# EAGLE design Hermit Board Rev A6 (EAGLE 6.6.0)
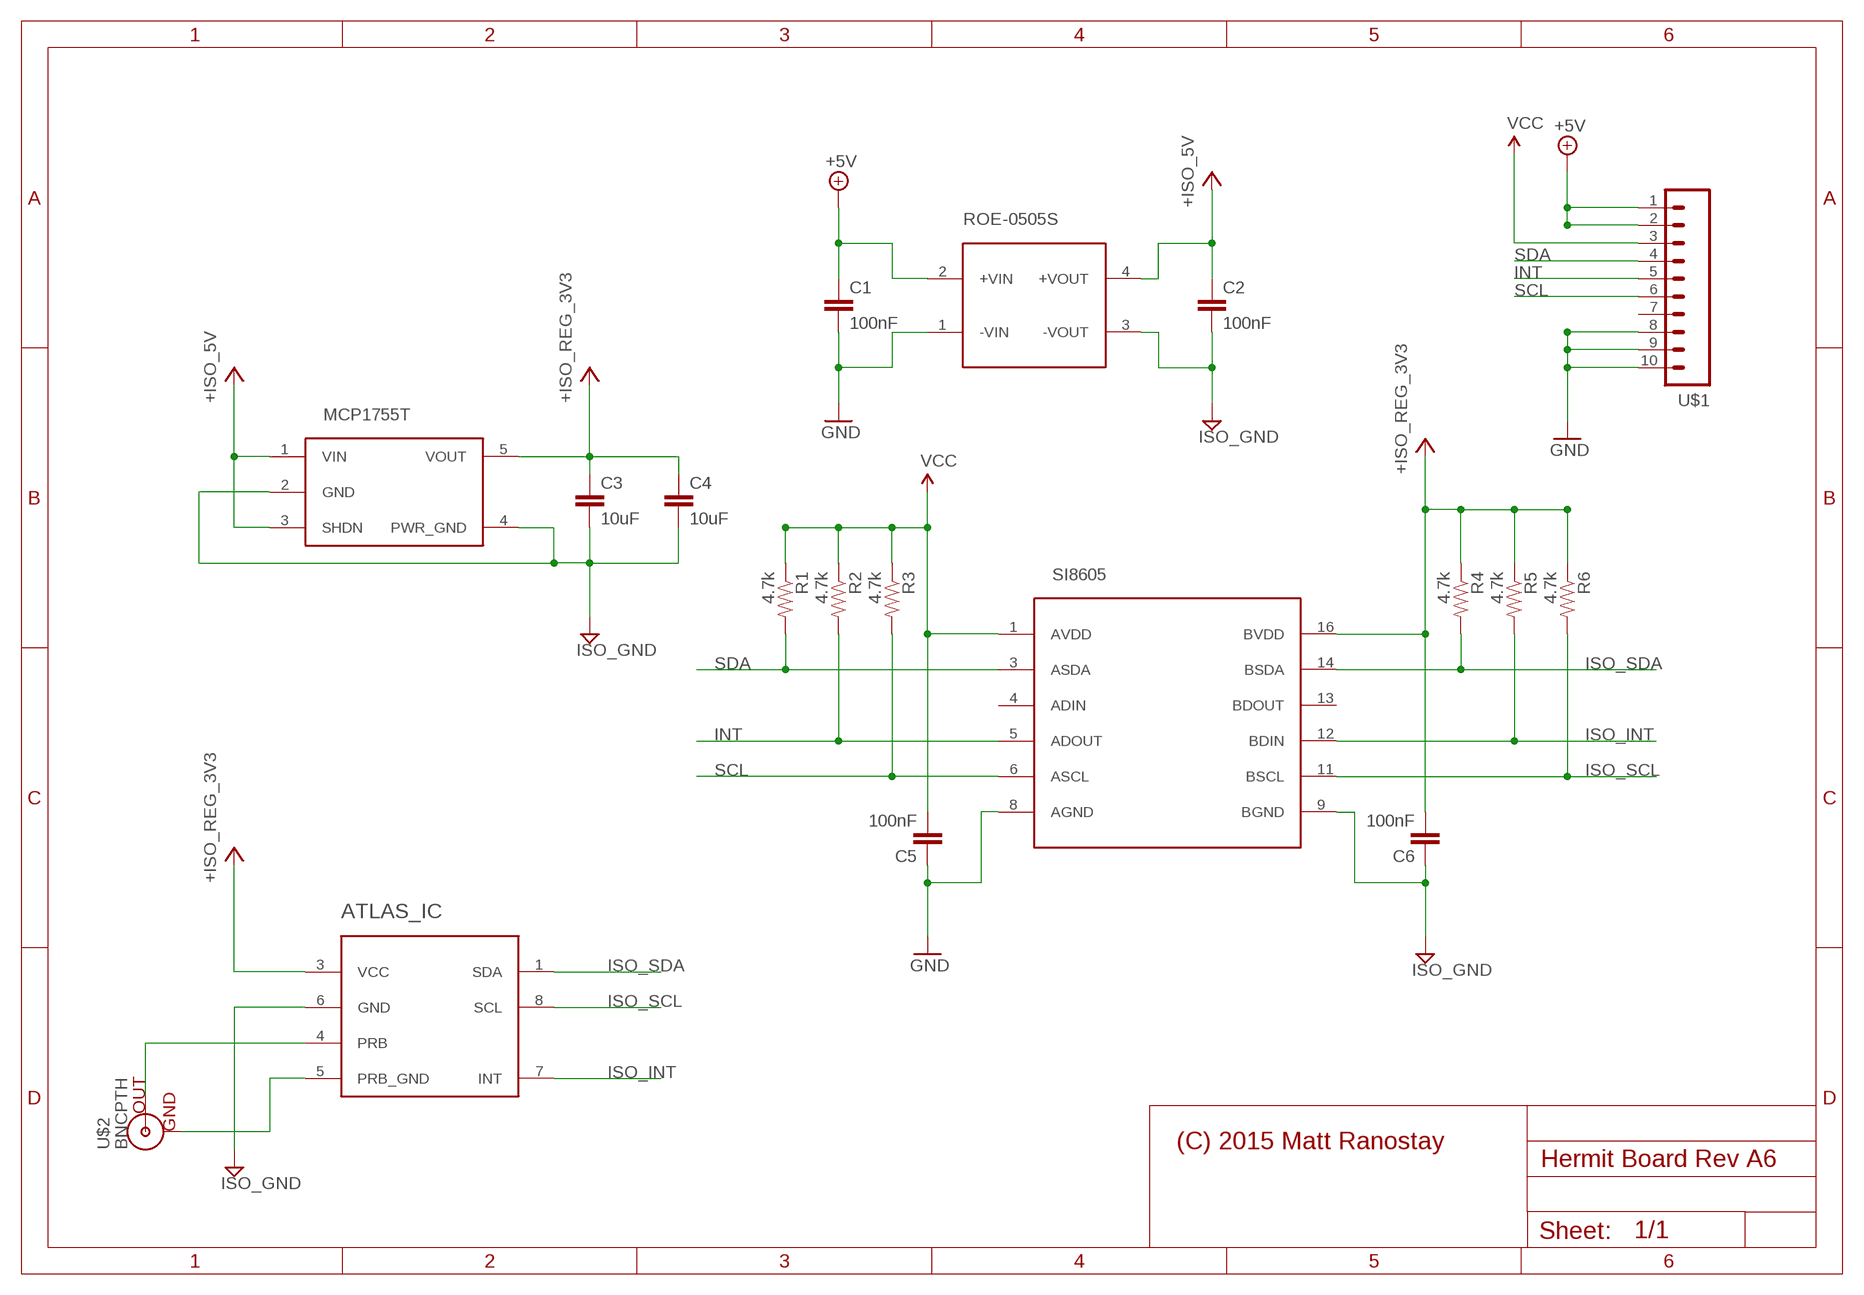
[diagram p0: schematic, sheet 1]

## Parts
ATLAS_IC  ATLAS-OEM  [ATLAS-OEM]
C1  100nF  CAP0805  [0805]
C2  100nF  CAP0805  [0805]
C3  10uF  CAP0805  [0805]
C4  10uF  CAP0805  [0805]
C5  100nF  CAP0805  [0805]
C6  100nF  CAP0805  [0805]
MCP1755T  MCP1755T  [SOT-23-5]
R1  4.7k  RESISTOR0805-RES  [0805]
R2  4.7k  RESISTOR0805-RES  [0805]
R3  4.7k  RESISTOR0805-RES  [0805]
R4  4.7k  RESISTOR0805-RES  [0805]
R5  4.7k  RESISTOR0805-RES  [0805]
R6  4.7k  RESISTOR0805-RES  [0805]
ROE-0505S  ROE-0505S  [SIP4]
SI8605  SI8605  [SOIC16-1.27-10X3.9MM]
U$1  M10SILK_FEMALE_PTH  [1X10]
U$2  BNCPTH  [BNC]

## Nets
+3V3: ATLAS_IC.3(VCC) C3.1 C4.1 C6.2 MCP1755T.5(VOUT) R4.1 R5.1 R6.1 SI8605.16(BVDD) ; supply symbol labelled +ISO_REG_3V3
+5V: C1.1 ROE-0505S.2(+VIN) U$1.1 U$1.2
+ISO_5V: C2.1 MCP1755T.1(VIN) MCP1755T.3(SHDN) ROE-0505S.4(+VOUT)
GND: C1.2 C5.1 ROE-0505S.1(-VIN) SI8605.8(AGND) U$1.8 U$1.9 U$1.10
INT: R2.2 SI8605.5(ADOUT) U$1.5
ISO_GND: ATLAS_IC.6(GND) C2.2 C3.2 C4.2 C6.1 MCP1755T.2(GND) MCP1755T.4(PWR_GND) ROE-0505S.3(-VOUT) SI8605.9(BGND)
ISO_INT: ATLAS_IC.7(INT) R5.2 SI8605.12(BDIN)
ISO_SCL: ATLAS_IC.8(SCL) R6.2 SI8605.11(BSCL)
ISO_SDA: ATLAS_IC.1(SDA) R4.2 SI8605.14(BSDA)
N$5: ATLAS_IC.4(PRB) U$2.S(OUT)
PRB_GND: ATLAS_IC.5(PRB_GND) U$2.GND
SCL: R3.2 SI8605.6(ASCL) U$1.6
SDA: R1.2 SI8605.3(ASDA) U$1.4
VCC: C5.2 R1.1 R2.1 R3.1 SI8605.1(AVDD) U$1.3
Unconnected: SI8605.4(ADIN) SI8605.13(BDOUT) U$1.7

## Notes on the sheet
- (C) 2015 Matt Ranostay

## Library data of the parts
ATLAS_IC = mranostay:ATLAS-OEM
C1-C6 = SparkFun-Capacitors:CAP: Capacitor Standard 0603 ceramic capacitor, and 0.1" leaded capacitor.
MCP1755T = mranostay:MCP1755T
R1-R6 = SparkFun-Passives:RESISTOR: Resistor Basic schematic elements and footprints for 0603, 1206, and PTH resistors.
ROE-0505S = mranostay:ROE-0505S
SI8605 = mranostay:SI8605
U$1 = SparkFun-Connectors:M10: Header 10 Standard 10-pin 0.1" header. Use with straight break away headers (SKU : PRT-00116), right angle break away headers (PRT-00553), swiss pins (PRT-00743), machine pins (PRT-00117), and female headers (PRT-00115).; PROD_ID: CONN-11563
U$2 = mranostay:BNC: BNC Connector, Mouser Part# 5227161

## Board
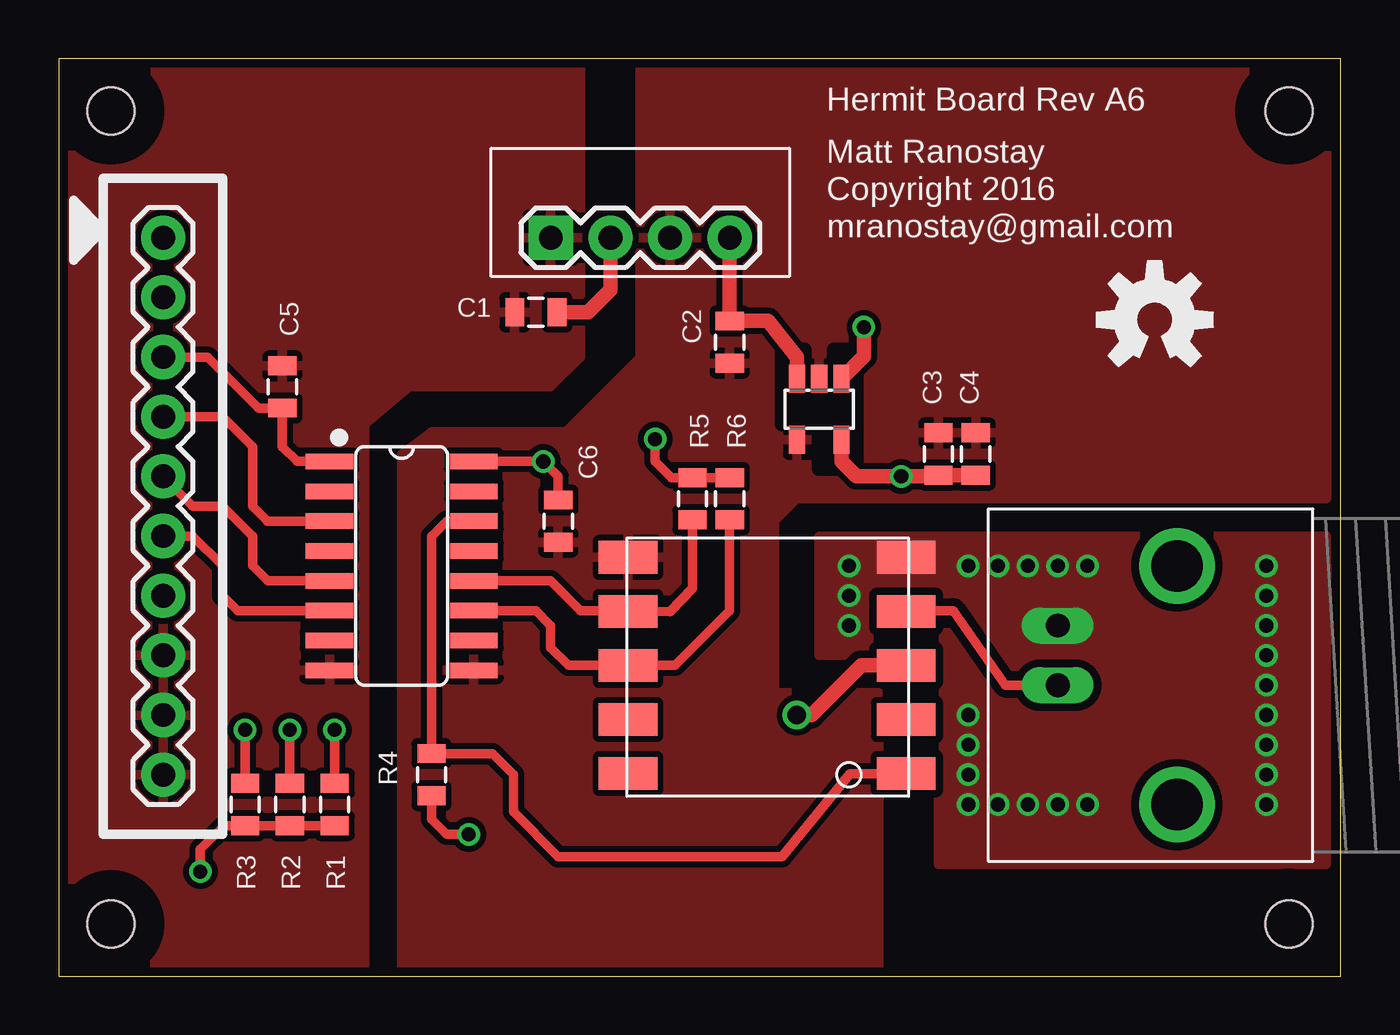
[diagram p1: board, top side]
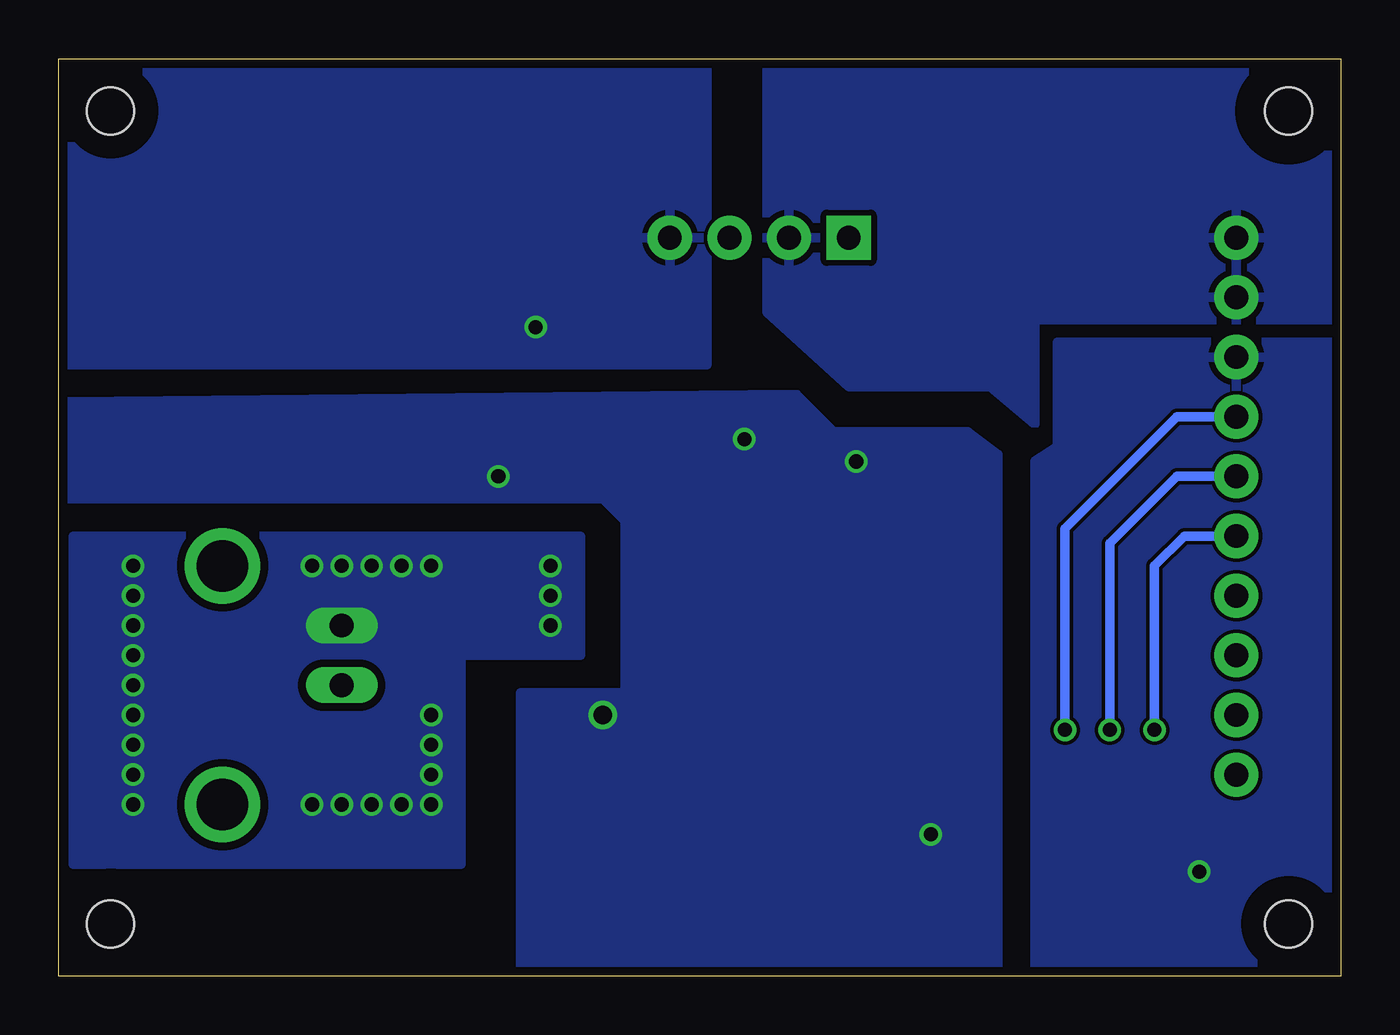
[diagram p2: board, bottom side, seen from below]

Size 54.6 x 39.05 mm. Coordinates in mm from the lower left corner, seen from the top.
Outline: 0,0 54.6,0 54.6,39.05 0,39.05 0,0
Copper layers (1*16): Top 0.0356mm / dielectric 1.5011mm / Bottom 0.0356mm
Design rules "oshpark-2layer": minimum track width 6mil, minimum drill 13mil, track to track 6mil, track to pad 6mil, pad to pad 6mil, via to via 6mil, smd to smd 6mil, copper to edge 15mil, drill to drill 6mil, minimum pad ring 7mil, minimum via ring 7mil, stop-mask expansion 2.5mil, vias tented up to drill 0mil, thermal gap 10mil
Holes 2.01 mm at 2.22,36.83 52.39,36.83 2.22,2.22 52.39,2.22
tRestrict: area 0.2,34.8 to 4.2,38.8; area 50.4,34.8 to 54.4,38.8; area 0.2,0.2 to 4.2,4.2; area 50.4,0.2 to 54.4,4.2; area 30.8,21.6 to 34,26.7
bRestrict: area 0.2,34.8 to 4.2,38.8; area 50.4,34.8 to 54.4,38.8; area 0.2,0.2 to 4.2,4.2; area 50.4,0.2 to 54.4,4.2

### Footprints (pad centres in the part's own frame; a part is rotated, then mirrored left to right if it is on the bottom)
ATLAS-OEM = smd 2.5 x 1.4: 1 -6.25,5.03; 2 -6.25,2.73; 3 -6.25,0.43; 4 -6.25,-1.87; 5 -6.25,-4.17; 6 5.601,-4.17; 7 5.601,-1.87; 8 5.601,0.43; 9 5.601,2.73; 10 5.601,5.03
0805 = smd 0.8 x 1.2: 1 -0.9,0; 2 0.9,0
SOT-23-5 = smd 0.69 x 1.2: 1 -0.95,-1.3; 2 0,-1.3; 3 0.95,-1.3; 4 0.95,1.3; 5 -0.95,1.3
SIP4 = drill 1.016 pad 1.88 square: 1 0,0 | drill 1.016 pad 1.88: 2 2.54,0; 3 5.08,0; 4 7.62,0
SOIC16-1.27-10X3.9MM = smd 0.66 x 2.032: 1 -4.445,-3.073; 2 -3.175,-3.073; 3 -1.905,-3.073; 4 -0.635,-3.073; 5 0.635,-3.073; 6 1.905,-3.073; 7 3.175,-3.073; 8 4.445,-3.073; 9 4.445,3.073; 10 3.175,3.073; 11 1.905,3.073; 12 0.635,3.073; 13 -0.635,3.073; 14 -1.905,3.073; 15 -3.175,3.073; 16 -4.445,3.073
1X10 = drill 1.016 pad 1.88: 1 0,0; 2 2.54,0; 3 5.08,0; 4 7.62,0; 5 10.16,0; 6 12.7,0; 7 15.24,0; 8 17.78,0; 9 20.32,0; 10 22.86,0
BNC = drill 2.2: 3 -5.08,5.08; 4 5.08,5.08 | drill 1.016 long: GND -2.54,0; S 0,0

### Placement (x,y rotation side)
ATLAS_IC  29.84,13.65 180 top
C1  20.32,28.26 180 top
C2  28.57,26.99 270 top
C3  37.47,22.23 90 top
C4  39.05,22.23 90 top
C5  9.53,25.08 270 top
C6  21.27,19.37 90 top
MCP1755T  32.38,24.13 180 top
R1  11.75,7.3 90 top
R2  9.84,7.3 90 top
R3  7.94,7.3 90 top
R4  15.88,8.57 90 top
R5  26.99,20.32 270 top
R6  28.57,20.32 270 top
ROE-0505S  20.95,31.43 0 top
SI8605  14.61,17.46 270 top
U$1  4.45,31.43 270 top
U$2  42.55,12.38 270 top
U$3  [OSHW-LOGO-M]  46.67,27.94 0 top

### Tracks (layer width: path | path; a pad name or v marks a point on that pad's centre or on a via)
+3V3  (via drill 0.6, 0.8)
  Top 0.406: R6.1 R5.1 26.09,21.22 25.4,21.91 v25.4,22.86 | SI8605.16 v20.64,21.91 21.27,21.27 C6.2 | 37.41,21.27 C3.1 | R4.1 15.88,6.67 16.51,6.03 v17.46,6.03
  Top 0.61: MCP1755T.5 33.34,21.91 33.97,21.27 v35.88,21.27 37.41,21.27 | C3.1 C4.1 | v31.43,11.11 32.07,11.11 34.18,13.22 ATLAS_IC.3
  pour Bottom (isolate 0.254): 14.61,0 14.61,22.23 15.88,23.18 21.59,23.18 23.18,24.77 54.29,24.45 54.29,20.32 31.43,20.32 30.48,19.37 30.48,12.06 34.92,12.06 34.92,0
+5V
  Top 0.61: ROE-0505S.2 23.5,29.21 22.54,28.26 C1.1
  pour Bottom (isolate 0.254): 0,27.94 0,39.05 24.45,39.05 24.45,28.26 20.95,25.08 14.92,25.08 13.02,23.5 13.02,27.94
+ISO_5V  (via drill 0.6)
  Top 0.61: ROE-0505S.4 C2.1 30.21,27.89 31.43,26.35 MCP1755T.3 | MCP1755T.1 34.29,26.39 v34.29,27.62
  pour Bottom: 26.99,39.05 26.99,26.04 54.29,26.04 54.29,39.05
GND
  pour Top (isolate 0.254): 0,0 0,39.05 22.23,39.05 22.23,26.35 20.95,25.08 14.92,25.08 13.02,23.5 13.02,0
INT  (via drill 0.6)
  Top 0.406: SI8605.5 8.89,16.83 8.26,17.46 8.26,18.73 6.99,20 5.71,20 U$1.5 | R2.2 v9.84,10.48
  Bottom 0.406: v9.84,10.48 9.84,18.41 6.99,21.27 U$1.5
ISO_GND
  pour Top (isolate 0.254): 14.61,0 14.61,22.23 15.88,23.18 21.59,23.18 24.77,26.35 24.77,39.05 54.29,39.05 54.29,20.64 53.98,20.32 31.43,20.32 30.48,19.37 30.48,12.06 34.92,12.06 34.92,0
ISO_INT
  Top 0.406: SI8605.12 20.95,16.83 22.23,15.56 24.21,15.56 ATLAS_IC.7 26.04,15.51 26.99,16.5 R5.2
ISO_SCL
  Top 0.406: 23.93,12.82 ATLAS_IC.8 | SI8605.11 20.32,15.56 20.95,14.92 20.95,13.97 21.7,13.22 ATLAS_IC.8 | R6.2 28.57,15.56 26.24,13.22 ATLAS_IC.8 | 24.45,13.02 ATLAS_IC.8 | 23.93,13.34 ATLAS_IC.8
ISO_SDA
  Top 0.406: SI8605.14 16.51,19.37 15.88,18.73 R4.2 18.47,9.47 19.37,8.57 19.37,6.99 21.27,5.08 30.8,5.08 33.7,8.62 ATLAS_IC.1
N$5
  Top 0.406: U$2.S 40.32,12.38 38.1,15.56 36.13,15.56 ATLAS_IC.4
PRB_GND  (via drill 0.6, 0.6 pad 0.81)
  other vias: 33.66,17.46 33.66,16.19 33.66,14.92 38.73,17.46 40.01,17.46 41.27,17.46 42.55,17.46 43.81,17.46 38.73,11.11 38.73,8.57 38.73,7.3 40.01,7.3 41.27,7.3 42.55,7.3 43.81,7.3 38.73,9.84 51.44,17.46 51.44,14.92 51.44,12.38 51.44,11.11 51.44,13.65 51.44,16.19 51.44,7.3 51.44,9.84 51.44,8.57
  pour Bottom (isolate 0.33, no thermals): 32.38,18.73 53.98,18.73 53.98,4.76 37.47,4.76 37.47,13.65 32.38,13.65
  pour Top (isolate 0.33, no thermals): 32.38,18.73 32.38,13.65 37.47,13.65 37.47,4.76 53.98,4.76 53.98,18.73
SCL  (via drill 0.6)
  Top 0.406: SI8605.6 7.62,15.56 6.99,16.19 6.99,17.46 5.71,18.73 U$1.6 | R3.2 v7.94,10.48
  Bottom 0.406: v7.94,10.48 7.94,17.46 6.67,18.73 U$1.6
SDA  (via drill 0.6)
  Top 0.406: 8.89,19.37 SI8605.3 | 8.89,19.37 8.26,20 8.26,22.54 6.99,23.81 U$1.4 | 8.89,19.37 8.88,19.37 | R1.2 v11.75,10.48
  Bottom 0.406: v11.75,10.48 11.75,19.05 6.99,23.81 U$1.4
VCC  (via drill 0.6)
  Top 0.406: SI8605.1 10.16,21.91 9.53,22.54 C5.2 8.52,24.18 6.35,26.35 U$1.3 | R3.1 R2.1 R1.1 7.04,6.4 6.03,5.4 v6.03,4.45
  pour Bottom: 0,26.99 12.06,26.99 12.06,22.54 13.02,21.91 13.02,0 0,0

### Text on the board
tPlace: Hermit Board Rev A6 | Matt Ranostay | Copyright 2016 | mranostay@gmail.com